# Altium project GameBoard_V1I1.PrjPcb (part 12 of 20)

## Sheet [29] - PWR IN, MECH, DOC.SchDoc
size A2; DocumentNumber: 28; SheetNumber: 28; SheetTotal: 32
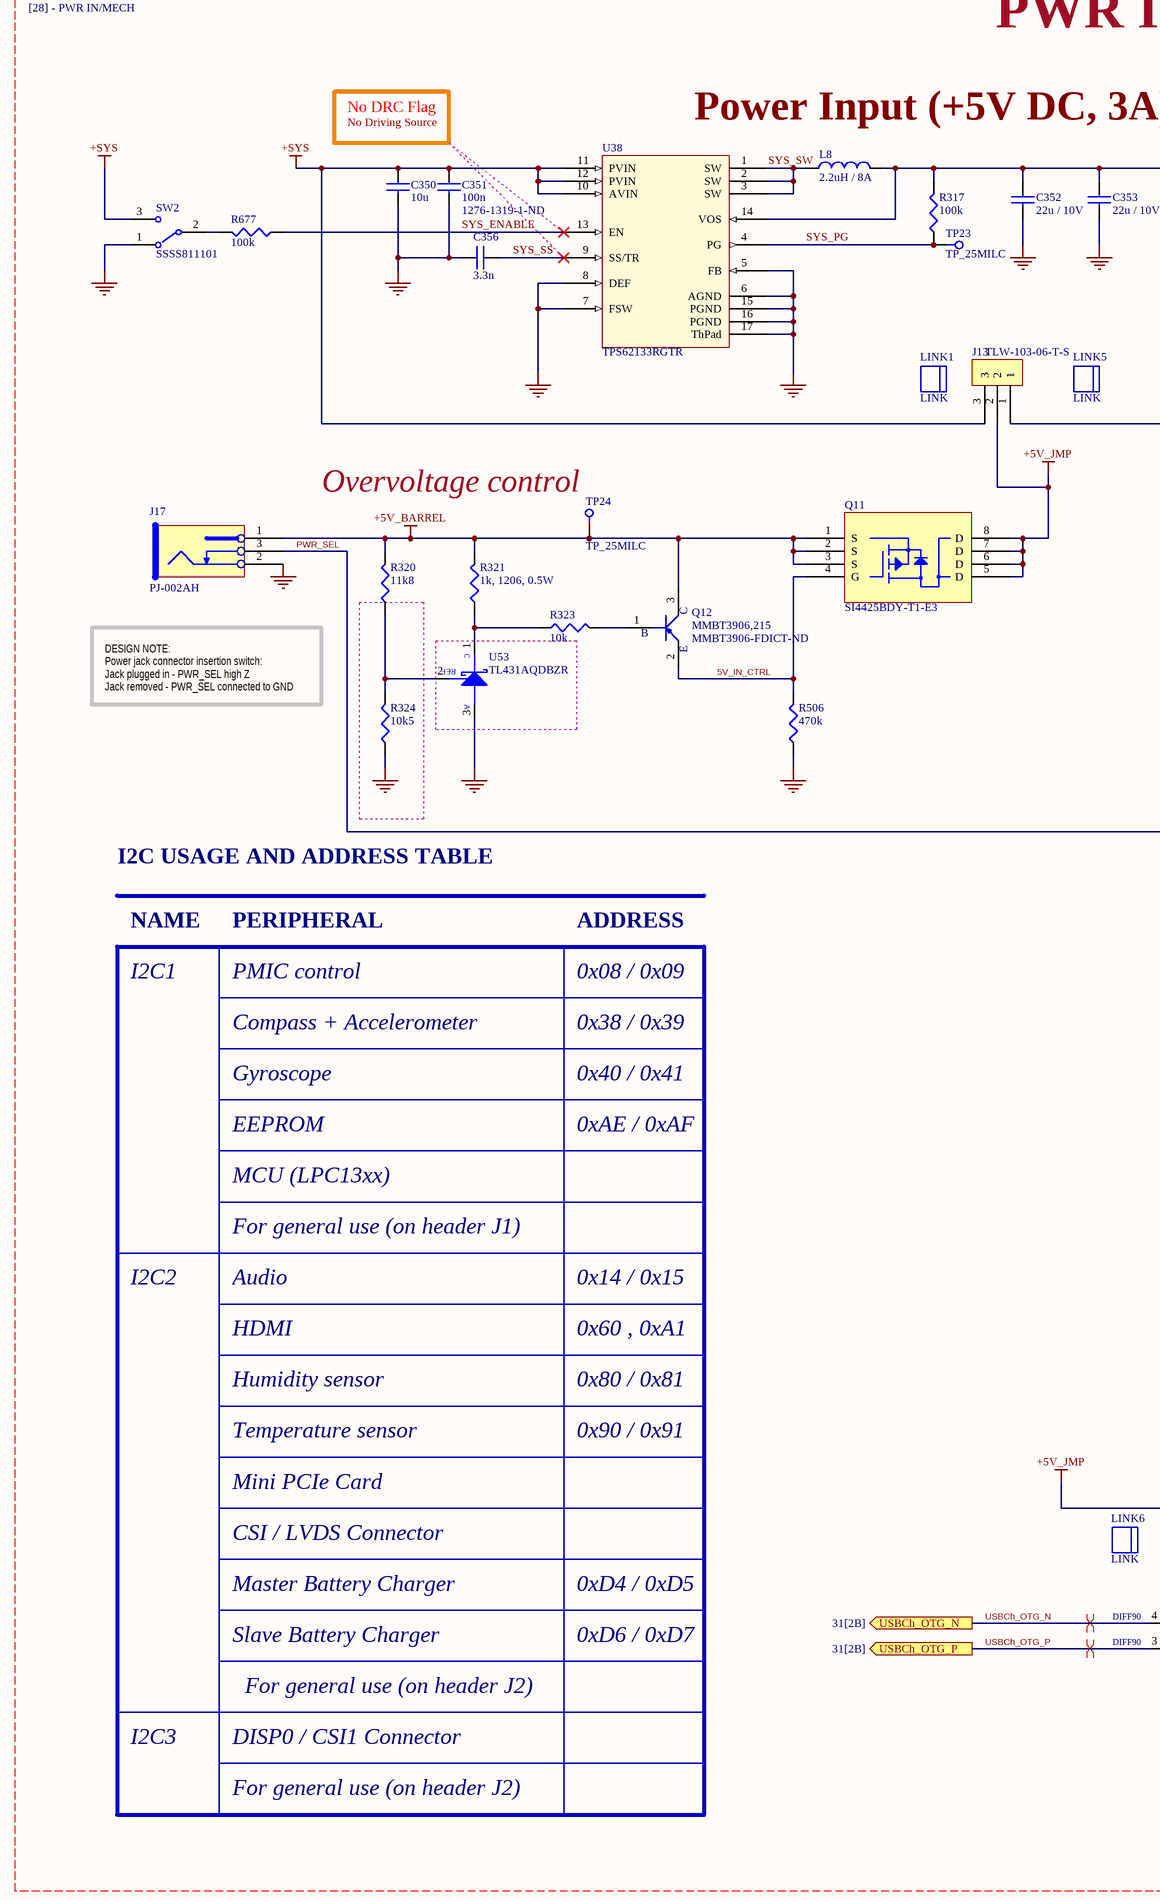
[diagram p66: [29] - PWR IN, MECH, DOC.SchDoc, left]
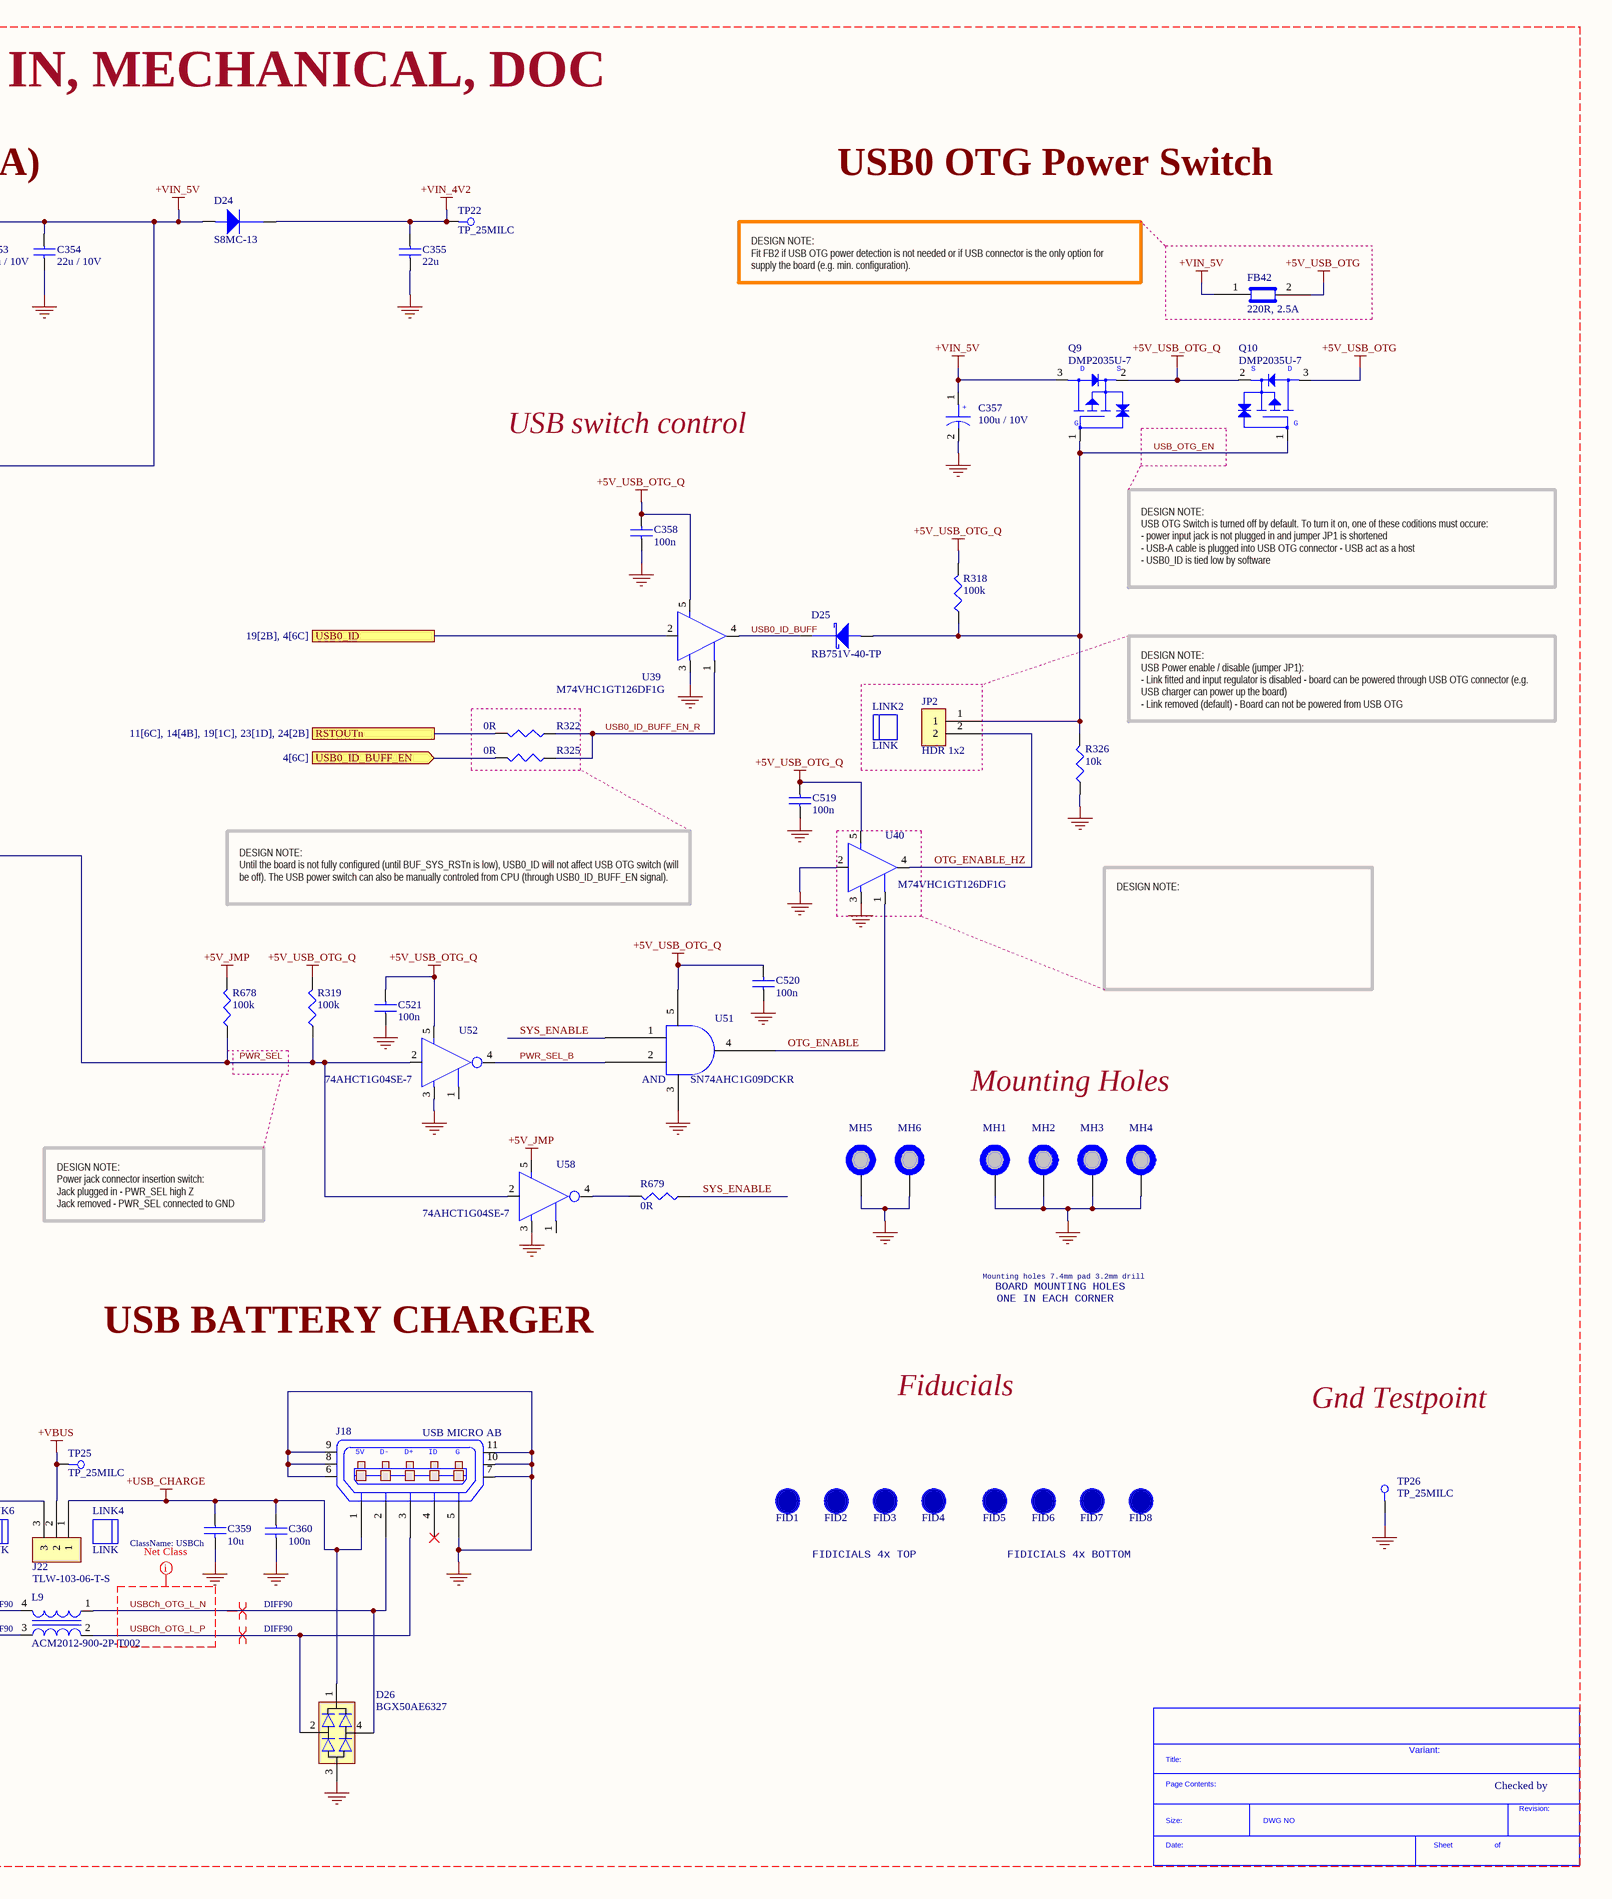
[diagram p67: [29] - PWR IN, MECH, DOC.SchDoc, right]

### Parts
(Parts that share a designator on the sheet are numbered #1, #2 ... from top to bottom, then left to right.)
*#22  SDTitleBlock  (value not drawn)  (graphical)
C350  10u  [C0603]
C351  100n  Supplier Part Number 2: 1276-1319-1-ND  [C0201]
C352  22u / 10V  [C0603]
C353  22u / 10V  [C0603]
C354  22u / 10V  [C0603]
C355  22u  [C0603]
C356  3.3n  [C0402]
C357  100u / 10V  [C2312]
C358  100n  [C0402]
C359  10u  [C0603]
C360  100n  [C0402]
C519  100n  [C0402]
C520  100n  [C0402]
C521  100n  [C0402]
D24  S8MC-13  [SMC]
D25  RB751V-40-TP  [SOD323]
D26  BGX50AE6327  [SOT143]
FB42  220R, 2.5A  [C0603]
FID1  FID_1MM_SMALL  [FID_40X52D]  (value not drawn)  (no BOM)
FID2  FID_1MM_SMALL  [FID_40X52D]  (value not drawn)  (no BOM)
FID3  FID_1MM_SMALL  [FID_40X52D]  (value not drawn)  (no BOM)
FID4  FID_1MM_SMALL  [FID_40X52D]  (value not drawn)  (no BOM)
FID5  FID_1MM_SMALL  [FID_40X52D]  (value not drawn)  (no BOM)
FID6  FID_1MM_SMALL  [FID_40X52D]  (value not drawn)  (no BOM)
FID7  FID_1MM_SMALL  [FID_40X52D]  (value not drawn)  (no BOM)
FID8  FID_1MM_SMALL  [FID_40X52D]  (value not drawn)  (no BOM)
J13  TLW-103-06-T-S  [HDR_1X3_2.54MM]
J17  PJ-002AH  [POWER_JACK_5.5_2.1MM_NS_v1.1]
J18  USB MICRO AB  [USB_Micro_AB]
J22  TLW-103-06-T-S  [HDR_1X3_2.54MM]
JP2  HDR 1x2  [HDR_1x2_2.54MM]
L8  2.2uH / 8A  [XFL4020-222MEC]
L9  ACM2012-900-2P-T002  [ACM2012]
LINK1  LINK  (mechanical)
LINK2  LINK  (mechanical)
LINK4  LINK  (mechanical)
LINK5  LINK  (mechanical)
LINK6  LINK  (mechanical)
MH1  MH_7.4MMC_3.2MMD  [MH_7.4MMD_3.2MMD]  (value not drawn)  (no BOM)
MH2  MH_7.4MMC_3.2MMD  [MH_7.4MMD_3.2MMD]  (value not drawn)  (no BOM)
MH3  MH_7.4MMC_3.2MMD  [MH_7.4MMD_3.2MMD]  (value not drawn)  (no BOM)
MH4  MH_7.4MMC_3.2MMD  [MH_7.4MMD_3.2MMD]  (value not drawn)  (no BOM)
MH5  MH_5MMC_2MMD  [MH_5MMD_2MMD]  (value not drawn)  (no BOM)
MH6  MH_5MMC_2MMD  [MH_5MMD_2MMD]  (value not drawn)  (no BOM)
Q9  DMP2035U-7  [SOT-23-3-123]
Q10  DMP2035U-7  [SOT-23-3-123]
Q11  SI4425BDY-T1-E3  [8_SOIC_3.9MM]
Q12  MMBT3906,215  Supplier Part Number 2: MMBT3906-FDICT-ND  [SOT-23-3-123]
R317  100k  [R0402]
R318  100k  [R0402]
R319  100k  [R0402]
R320  11k8  [R0402]
R321  1k, 1206, 0.5W  [R1206]
R322  0R  [R0402]
R323  10k  [R0402]
R324  10k5  [R0402]
R325  0R  [R0402]
R326  10k  [R0402]
R506  470k  [R0402]
R677  100k  [R0402]
R678  100k  [R0402]
R679  0R  [R0402]
SW2  SSSS811101  [SSSS811101]
TP22  TP_25MILC  [TP_25C]  (no BOM)
TP23  TP_25MILC  [TP_25C]  (no BOM)
TP24  TP_25MILC  [TP_25C]  (no BOM)
TP25  TP_25MILC  [TP_25C]  (no BOM)
TP26  TP_25MILC  [TP_25C]  (no BOM)
U38  TPS62133RGTR  [QFN16_3MMx3MM]
U39  M74VHC1GT126DF1G  [SC70_5]
U40  M74VHC1GT126DF1G  [SC70_5]
U51  SN74AHC1G09DCKR  [SC70_5]
U52  74AHCT1G04SE-7  [SOT353]
U53  TL431AQDBZR  [SOT-23-3-123]
U58  74AHCT1G04SE-7  [SOT353]

### Ports
RSTOUTn (see 11[6C], 14[4B], 19[1C], 23[1D], 24[2B]), USB0_ID (see 19[2B], 4[6C]), USB0_ID_BUFF_EN (in, see 4[6C]), USBCh_OTG_N (out, see 31[2B]), USBCh_OTG_P (out, see 31[2B])

### Nets
+5V_BARREL: J17.1 Q11.1(S) Q11.2(S) Q11.3(S) Q12.3(C) R320.2 R321.2 TP24.1
+5V_JMP: J13.2 J22.3 Q11.5(D) Q11.6(D) Q11.7(D) Q11.8(D) R678.2 U58.5(VCC)
+5V_USB_OTG: FB42.2 Q10.3
+5V_USB_OTG_Q: C358.2 C519.2 C520.2 C521.2 Q9.2 Q10.2 R318.2 R319.2 U39.5(VCC) U40.5(VCC) U51.5(VCC) U52.5(VCC)
+SYS: C350.1 C351.1 J13.3 SW2.3 U38.10(AVIN) U38.11(PVIN) U38.12(PVIN)
+USB_CHARGE: C359.1 C360.1 D26.1 J18.1(P1) J22.1
+VBUS: J22.2 TP25.1
+VIN_4V2: C355.1 D24.1(Cathode) TP22.1
+VIN_5V: C352.1 C353.1 C354.1 C357.1 D24.2(Anode) FB42.1 J13.1 L8.2 Q9.3 R317.2 U38.14(VOS)
GND: C350.2 C351.2 C352.2 C353.2 C354.2 C355.2 C356.1 C357.2 C358.1 C359.2 C360.2 C519.1 C520.1 C521.1 D26.3 J17.2 J18.5(P5) J18.6 J18.7 J18.8 J18.9 J18.10 J18.11 MH1.1 MH2.1 MH3.1 MH4.1 MH5.1 MH6.1 R324.1 R326.1 R506.1 SW2.1 TP26.1 U38.5(FB) U38.6(AGND) U38.7(FSW) U38.8(DEF) U38.15(PGND) U38.16(PGND) U38.17(ThPad) U39.3(GND) U40.2(I) U40.3(GND) U51.3(GND) U52.3(GND) U53.3(ANODE) U58.3(GND)
5V_IN_CTRL: Q11.4(G) Q12.2(E) R506.2
OTG_ENABLE: U40.1(OE#) U51.4(Y)
OTG_ENABLE_HZ: JP2.2 U40.4(O)
PWR_SEL: J17.3 R319.1 R678.1 U52.2(I) U58.2(I)
PWR_SEL_B: U51.2(B) U52.4(O)
RSTOUTn: R322.2 ; port RSTOUTn
SYS_ENABLE: R677.1 R679.1 U38.13(EN) U51.1(A)
SYS_PG: R317.1 TP23.1 U38.4(PG)
SYS_SS: C356.2 U38.9(SS/TR)
SYS_SW: L8.1 U38.1(SW) U38.2(SW) U38.3(SW)
USB0_ID: U39.2(I) ; port USB0_ID
USB0_ID_BUFF: D25.1(cathode) U39.4(O)
USB0_ID_BUFF_EN: R325.2 ; port USB0_ID_BUFF_EN
USB0_ID_BUFF_EN_R: R322.1 R325.1 U39.1(OE#)
USB_OTG_EN: D25.2(ANODE) JP2.1 Q9.1 Q10.1 R318.1 R326.2
USBCh_OTG_L_N: D26.4 J18.2(P2) L9.1
USBCh_OTG_L_P: D26.2 J18.3(P3) L9.2
USBCh_OTG_N: L9.4 ; port USBCh_OTG_N
USBCh_OTG_P: L9.3 ; port USBCh_OTG_P
NetQ12_1: Q12.1(B) R323.2
NetR320_1: R320.1 R324.2 U53.2(REF)
NetR321_1: R321.1 R323.1 U53.1(cathode)
NetR677_2: R677.2 SW2.2
NetR679_2: R679.2 U58.4(O)

Not connected (* = marked no-connect by the designer): J18 4(P4)*; U52 1(OE#); U58 1(OE#)

### Layout directives
differential pair; net class DIFF90: USBCh_OTG_L_N, USBCh_OTG_L_P, USBCh_OTG_N, USBCh_OTG_P
net class USBCh: USBCh_OTG_L_N, USBCh_OTG_L_P
net class [28] - PWR IN/MECH: 5V_IN_CTRL, +5V_BARREL, +5V_JMP, +5V_USB_OTG, +5V_USB_OTG_Q, +SYS, +USB_CHARGE, +VBUS, +VIN_4V2, +VIN_5V, GND, OTG_ENABLE, OTG_ENABLE_HZ, PWR_SEL, PWR_SEL_B, SYS_ENABLE, SYS_PG, SYS_SS, SYS_SW, USB0_ID_BUFF, USB0_ID_BUFF_EN_R, USB_OTG_EN, USBCh_OTG_L_N, USBCh_OTG_L_P, USBCh_OTG_N, USBCh_OTG_P

### Notes on the sheet
- PWR IN, MECHANICAL, DOC
- No DRC Flag
- No Driving Source
- Power Input (+5V DC, 3A)
- USB0 OTG Power Switch
- DESIGN NOTE:
  Fit FB2 if USB OTG power detection is not needed or if USB connector is the only option for supply the board (e.g. min. configuration).
- USB switch control
- (near TP24) Overvoltage control
- DESIGN NOTE:
  USB OTG Switch is turned off by default. To turn it on, one of these coditions must occure:
  - power input jack is not plugged in and jumper JP1 is shortened
  - USB-A cable is plugged into USB OTG connector - USB act as a host
  - USB0_ID is tied low by software
- DESIGN NOTE:
  Power jack connector insertion switch:
  Jack plugged in - PWR_SEL high Z
  Jack removed - PWR_SEL connected to GND
- DESIGN NOTE:
  USB Power enable / disable (jumper JP1):
  - Link fitted and input regulator is disabled - board can be powered through USB OTG connector (e.g. USB charger can power up the board)
  - Link removed (default) - Board can not be powered from USB OTG
- I2C USAGE AND ADDRESS TABLE
- NAME
- PERIPHERAL
- ADDRESS
- DESIGN NOTE:
  Until the board is not fully configured (until BUF_SYS_RSTn is low), USB0_ID will not affect USB OTG switch (will be off). The USB power switch can also be manually controled from CPU (through USB0_ID_BUFF_EN signal).
- DESIGN NOTE:
- I2C1
- PMIC control
- 0x08 / 0x09
- Compass + Accelerometer
- 0x38 / 0x39
- Gyroscope
- 0x40 / 0x41
- Mounting Holes
- MCU (LPC13xx)
- EEPROM
- 0xAE / 0xAF
- For general use (on header J1)
- I2C2
- Audio
- 0x14 / 0x15
- Mounting holes 7.4mm pad 3.2mm drill
- BOARD MOUNTING HOLES
- ONE IN EACH CORNER
- HDMI
- 0x60 , 0xA1
- USB BATTERY CHARGER
- Temperature sensor
- Humidity sensor
- 0x90 / 0x91
- 0x80 / 0x81
- Fiducials
- Gnd Testpoint
- Mini PCIe Card
- CSI / LVDS Connector
- FIDICIALS 4x TOP
- FIDICIALS 4x BOTTOM
- Master Battery Charger
- 0xD4 / 0xD5
- Slave Battery Charger
- For general use (on header J2)
- 0xD6 / 0xD7
- I2C3
- DISP0 / CSI1 Connector
- Variant:
- Checked by
- (in symbol 0475890001) 5V; D-; D+; ID; G
- (in symbol DMP2035U-7) D; S; G
- (in symbol SDTitleBlock) Title:; Page Contents:; Revision:; Size:; DWG NO; Date:; Sheet; of
- (in symbol SN74AHC1G09DCKR) AND
- (in symbol TL431AQDBZR) C; A
- (in symbol TPSC107K010R0150) +

### Library data of the parts
C350 C359 = C1608X5R0J106M: CAP CER 10UF 6.3V X5R 20% 0603; Manufacturer: TDK Corporation; Capacitance: 10µF; Value: 10µF; .Checked PCB: used; Category: Capacitors; Supplier Part Number: 445-4112-1-ND; Manufacturer Part Number: C1608X5R0J106M; Operating Temperature: -55°C ~ 85°C; Package / Case: 0603 (1608 Metric); Price 1k [$]: 0.08580; .Checked SCH: used; Voltage - Rated: 6.3V; Features: Low ESR; Supplier: Digikey; Supplier 1: Digi-Key; Supplier Part Number 1: 445-4112-1-ND; RoHS: RoHS Compliant; Stock 1: 48157; Pricing 1: 1=0.46, 10=0.363, 100=0.1898, 250=0.14024, 500=0.1089, 1000=0.0858 (USD); Tolerance: ±20%; Temperature Coefficient: X5R; Mounting Type: Surface Mount, MLCC; Applications: General Purpose; Ratings: -; Size / Dimension: 0.063" L x 0.031" W (1.60mm x 0.80mm); Height - Seated (Max): -; Thickness (Max): 0.037" (0.95mm); Lead Spacing: -; Packaging: Cut Tape (CT); Lead Style: -; ComponentLink1URL: http://www.tdk.com/pdf/general_B11.pdf; ComponentLink1Description: http://www.tdk.com/pdf/general_B11.pdf
C351 = C0603X5R1C104K030BC: CAP CER 0.1UF 16V 10% X5R 0201; Manufacturer: TDK Corporation; Capacitance: 0.1µF; .Creator: MM; .Checked PCB: used; Supplier 1: Digi-Key; Manufacturer Part Number: C0603X5R1C104K030BC; RoHS: RoHS Compliant; Category: Capacitors; Stock 1: 19491; Pricing 1: 1=0.1, 10=0.046, 100=0.0209, 250=0.01712, 500=0.01464, 1000=0.0114, 5000=0.0095 (USD); Packaging: Cut Tape (CT); Tolerance: ±10%; Voltage - Rated: 16V; Temperature Coefficient: X5R; Mounting Type: Surface Mount, MLCC; Operating Temperature: -55°C ~ 85°C; Applications: General Purpose; Ratings: -; Package / Case: 0201 (0603 Metric); Size / Dimension: 0.024" L x 0.012" W (0.60mm x 0.30mm); Height - Seated (Max): -; Thickness (Max): 0.013" (0.33mm); Lead Spacing: -; Features: -; Lead Style: -; ComponentLink1URL: http://product.tdk.com/en/catalog/datasheets/mlcc_commercial_general_en.pdf; ComponentLink1Description: http://product.tdk.com/en/catalog/datasheets/mlcc_commercial_general_en.pdf; Supplier Part Number 1: 445-7313-1-ND; .Checked SCH: used; Supplier 2: Digi-Key
C352-C354 = C1608X5R1A226M080AC: as C459 on sheet [30] - PWR PMIC; Supplier 1: Digi-Key; Manufacturer Part Number: C1608X5R1A226M080AC; RoHS: RoHS Compliant; Category: Capacitors; Stock 1: 405620; Pricing 1: 1=0.49, 10=0.469, 100=0.2275, 250=0.189, 500=0.1715, 1000=0.1575 (USD); Packaging: Cut Tape (CT); Voltage - Rated: 10V; Temperature Coefficient: X5R; Mounting Type: Surface Mount, MLCC; Operating Temperature: -55°C ~ 85°C; Applications: General Purpose; Ratings: -; Package / Case: 0603 (1608 Metric); Size / Dimension: 0.063" L x 0.031" W (1.60mm x 0.80mm); Height - Seated (Max): -; Thickness (Max): 0.035" (0.90mm); Lead Spacing: -; Features: -; Lead Style: -; ComponentLink1URL: http://product.tdk.com/en/catalog/datasheets/mlcc_commercial_general_en.pdf; ComponentLink1Description: http://product.tdk.com/en/catalog/datasheets/mlcc_commercial_general_en.pdf; Supplier Part Number 1: 445-9077-1-ND; .Checked PCB: used; Supplier 2: Digi-Key; Supplier Part Number 2: 1276-1274-1-ND
C355 = C1608X5R0J226M080AC: as C453-C455 on sheet [30] - PWR PMIC; Supplier 1: Digi-Key; Manufacturer Part Number: C1608X5R0J226M080AC; RoHS: RoHS Compliant; Category: Capacitors; Stock 1: 593047; Pricing 1: 1=0.39, 10=0.343, 100=0.1714, 250=0.13708, 500=0.12484, 1000=0.1104 (USD); Packaging: Cut Tape (CT); Tolerance: ±20%; Voltage - Rated: 6.3V; Temperature Coefficient: X5R; Mounting Type: Surface Mount, MLCC; Operating Temperature: -55°C ~ 85°C; Applications: General Purpose; Ratings: -; Package / Case: 0603 (1608 Metric); Size / Dimension: 0.063" L x 0.031" W (1.60mm x 0.80mm); Height - Seated (Max): -; Thickness (Max): 0.039" (1.00mm); Lead Spacing: -; Features: -; Lead Style: -; ComponentLink1URL: http://product.tdk.com/en/catalog/datasheets/mlcc_commercial_general_en.pdf; ComponentLink1Description: http://product.tdk.com/en/catalog/datasheets/mlcc_commercial_general_en.pdf; Supplier Part Number 1: 445-8028-1-ND; .Checked SCH: used
C356 = CL05B332JA5NNNC: CAP CER 3300PF 25V X7R 0402; Manufacturer: Samsung Electro-Mechanics; Tolerance: ±5%; Notification: Current market demand for these product types have resulted in fluctuating and extending lead times. Lead times may differ.; .Creator: MB; Supplier 1: Digi-Key; Manufacturer Part Number: CL05B332JA5NNNC; RoHS: RoHS Compliant; Category: Capacitors; Stock 1: 78906; Pricing 1: 1=0.1, 10=0.064, 100=0.0285, 500=0.02034, 1000=0.01598, 2500=0.01453, 5000=0.01337 (USD); Packaging: Cut Tape (CT); Part Status: Active; Voltage - Rated: 25V; Temperature Coefficient: X7R; Operating Temperature: -55°C ~ 125°C; Features: -; Ratings: -; Applications: General Purpose; Mounting Type: Surface Mount, MLCC; Package / Case: 0402 (1005 Metric); Size / Dimension: 0.039" L x 0.020" W (1.00mm x 0.50mm); Height - Seated (Max): -; Thickness (Max): 0.022" (0.55mm); Lead Spacing: -; Lead Style: -; ComponentLink1URL: https://media.digikey.com/pdf/Data%20Sheets/Samsung%20PDFs/CL05B105KQ5NQNC_Spec.pdf; ComponentLink1Description: https://media.digikey.com/pdf/Data%20Sheets/Samsung%20PDFs/CL05B105KQ5NQNC_Spec.pdf; Supplier Part Number 1: 1276-1547-1-ND; .Checked PCB: *; .Checked SCH: *
C357 = TPSC107K010R0150: CAP TANT 100UF 10V 10% 2312; Manufacturer: AVX Corporation; Manufacturer Size Code: C; Capacitance: 100µF; ESR (Equivalent Series Resistance): 150 mOhm; Type: Molded; .Creator: MM; .Checked PCB: used; Supplier 1: Digi-Key; Manufacturer Part Number: TPSC107K010R0150; RoHS: RoHS Compliant; Category: Capacitors; Stock 1: 3211; Pricing 1: 1=1, 10=0.85, 100=0.4969, 250=0.4168 (USD); Packaging: Cut Tape (CT); Tolerance: ±10%; Voltage - Rated: 10V; Operating Temperature: -55°C ~ 125°C; Mounting Type: Surface Mount; Package / Case: 2312 (6032 Metric); Size / Dimension: 0.236" L x 0.126" W (6.00mm x 3.20mm); Height - Seated (Max): 0.110" (2.80mm); Lead Spacing: -; Features: General Purpose; Lifetime @ Temp.: -; ComponentLink1URL: http://www.avx.com/docs/Catalogs/tps.pdf; ComponentLink1Description: http://www.avx.com/docs/Catalogs/tps.pdf; Supplier Part Number 1: 478-7995-1-ND; .Checked SCH: used
C358 C360 C519-C521 = C1005X5R1H104K: as C426 on sheet [30] - PWR PMIC; Category: Capacitors; Supplier Part Number: 445-5942-1-ND; Manufacturer Part Number: C1005X5R1H104K; Operating Temperature: -55°C ~ 85°C; Package / Case: 0402 (1005 Metric); Price 1k [$]: 0.02340; .Checked SCH: used; Voltage - Rated: 50V; Supplier: Digikey; Supplier 1: Digi-Key; Supplier Part Number 1: 445-5942-1-ND; RoHS: RoHS Compliant; Stock 1: 106926; Pricing 1: 1=0.27, 10=0.18, 100=0.072, 250=0.05176, 500=0.0369, 1000=0.027 (USD); Tolerance: ±10%; Temperature Coefficient: X5R; Mounting Type: Surface Mount, MLCC; Applications: General Purpose; Ratings: -; Size / Dimension: 0.039" L x 0.020" W (1.00mm x 0.50mm); Height - Seated (Max): -; Thickness (Max): 0.022" (0.55mm); Lead Spacing: -; Features: -; Packaging: Cut Tape (CT); Lead Style: -; ComponentLink1URL: http://www.tdk.co.jp/tefe02/e412_c.pdf; ComponentLink1Description: http://www.tdk.co.jp/tefe02/e412_c.pdf; Supplier 2: Digi-Key; Supplier Part Number 2: 311-1697-6-ND
D24 = S8MC-13: DIODE GEN PURP 1KV 8A SMC; Manufacturer: Diodes Incorporated; Diode Type: Standard; Voltage - DC Reverse (Vr) (Max): 1000V (1kV); Voltage - Forward (Vf) (Max) @ If: 985mV @ 8A; Speed: Standard Recovery >500ns, > 200mA (Io); Current - Reverse Leakage @ Vr: 10µA @ 1000V; Capacitance @ Vr, F: 40pF @ 4V, 1MHz; .Checked PCB: used; .Creator: MM; Supplier 1: Digi-Key; Manufacturer Part Number: S8MC-13; RoHS: RoHS Compliant; Category: Discrete Semiconductor Products; Stock 1: 79939; Pricing 1: 1=0.66, 10=0.578, 25=0.5104, 100=0.4448, 250=0.3872, 500=0.3296, 1000=0.264 (USD); Packaging: Cut Tape (CT); Current - Average Rectified (Io): 8A; Reverse Recovery Time (trr): -; Mounting Type: Surface Mount; Package / Case: DO-214AB, SMC; Supplier Device Package: SMC; Operating Temperature - Junction: -65°C ~ 150°C; ComponentLink1URL: http://www.diodes.com/datasheets/ds31117.pdf; ComponentLink1Description: http://www.diodes.com/datasheets/ds31117.pdf; Supplier Part Number 1: S8MCDICT-ND; .Checked SCH: used
D25 = RB751V-40-TP: DIODE SCHTKY 30MA 30V SOD-323; Manufacturer: Micro Commercial Co; Diode Type: Schottky; Voltage - Forward (Vf) (Max) @ If: 370mV @ 1mA; Speed: Small Signal =< 200mA (Io), Any Speed; Current - Reverse Leakage @ Vr: 500nA @ 30V; Capacitance @ Vr, F: 2pF @ 1V, 1MHz; .Checked PCB: used; Supplier 1: Digi-Key; Supplier Part Number 1: RB751V-40-TPMSCT-ND; Manufacturer Part Number: RB751V-40-TP; RoHS: RoHS Compliant; Category: Discrete Semiconductor Products; Stock 1: 18964; Pricing 1: 1=0.48, 10=0.342, 100=0.2014, 250=0.14252, 500=0.1216, 1000=0.095 (USD); Voltage - DC Reverse (Vr) (Max): 30V; Current - Average Rectified (Io): 30mA; Reverse Recovery Time (trr): -; Mounting Type: Surface Mount; Package / Case: SC-76, SOD-323; Supplier Device Package: SOD-323; Packaging: Cut Tape (CT); ComponentLink1URL: http://www.mccsemi.com/up_pdf/RB751V-40(SOD-323).PDF; ComponentLink1Description: Data Sheet; .Checked SCH: used
D26 = BGX50AE6327: DIODE SWITCHING 50V SOT-143; Manufacturer: Infineon Technologies; .Checked PCB: used; Current - DC Forward (If): 140mA; Diode Type: Single Phase; Speed: Small Signal =< 200mA (Io), Any Speed; Reverse Recovery Time (trr): 6ns; .Checked SCH: used; Category: Discrete Semiconductor Products; Family: Bridge Rectifiers; Manufacturer Part Number: BGX50AE6327; Package / Case: TO-253-4, TO-253AA; Price 1k [$]: 0.10013; Supplier: Digikey; Supplier Part Number: BGX50AINCT-ND; Value: BGX50AE6327; Supplier 1: Digi-Key; Supplier Part Number 1: BGX50AINCT-ND; RoHS: RoHS Compliant; Stock 1: 438; Pricing 1: 1=0.47, 10=0.334, 100=0.2225, 500=0.12906, 1000=0.10013 (USD); Voltage - Peak Reverse (Max): 50V; Mounting Type: Surface Mount; Packaging: Cut Tape (CT); Supplier Device Package: PG-SOT143-4; ComponentLink1URL: http://www.infineon.com/dgdl/bgx50aseries.pdf?folderId=db3a30431400ef6801141cc1c4cd04e8&fileId=db3a30431400ef6801141cc423c404e9; ComponentLink1Description: http://www.infineon.com/dgdl/bgx50aseries.pdf?folderId=db3a30431400ef6801141cc1c4cd04e8&fileId=db3a30431400ef6801141cc423c404e9
FB42 = BLM18SG221TN1D: FERRITE CHIP 220 OHM 2500MA 0603; Manufacturer: Murata Electronics North America; Impedance @ Frequency: 220 Ohm @ 100MHz; DC Resistance (DCR): 40 mOhm Max; Filter Type: Differential Mode - Single; Number of Lines: 1; .Checked PCB: used; Supplier 1: Digi-Key; Supplier Part Number 1: 490-5225-1-ND; Manufacturer Part Number: BLM18SG221TN1D; RoHS: RoHS Compliant; Category: Filters; Stock 1: 54640; Pricing 1: 1=0.38, 10=0.282, 50=0.1646, 100=0.1316, 250=0.094, 500=0.06392, 1000=0.0517, 5000=0.04042 (USD); Current Rating: 2.5A; Package / Case: 0603 (1608 Metric); Mounting Type: Surface Mount; Packaging: Cut Tape (CT); Height (Max): 0.037" (0.95mm); Size / Dimension: 0.063" L x 0.031" W (1.60mm x 0.80mm); ComponentLink1URL: http://search.murata.co.jp/Ceramy/image/img/PDF/ENG/L0110S0100BLM18S.pdf; ComponentLink1Description: http://search.murata.co.jp/Ceramy/image/img/PDF/ENG/L0110S0100BLM18S.pdf; .Checked SCH: used
FID1-FID8 = FID_1MM_SMALL: Fiducial 40mil Diameter, 52mil Mask; .Checked PCB: used; Supplier: Digikey; .Checked SCH: used
J13 J22 = TLW-103-06-T-S: CONN HEADER 3 POS 2.54mm Solder ST Thru-Hole; Manufacturer: Samtec; Number of Contacts: 3; Gender: Male; Max Current Rating: 3A; Connector Type: Male Pin; .Creator: MB; Supplier 1: Digi-Key; Manufacturer Part Number: TLW-103-06-T-S; Stock 1: 1017; Pricing 1: 1=1.02, 10=0.913, 100=0.7517, 500=0.59422, 1000=0.51009, 5000=0.46535, 10000=0.44745 (USD); Mount: Through Hole; Contact Plating: Nickel,Tin; Contact Material: Bronze; Colour: Black; Housing Colour: Black; Housing Material: Polymer; Min Operating Temperature: -55°C; Max Operating Temperature: 105°C; Number of Rows: 1; Packaging: Bulk; Termination: Solder; Package Quantity: 1; Number of Positions: 3; Orientation: Straight; Length: 7.62mm; Pitch: 2.54mm; Contact Mating Length: 0.105inch; Depth: 2.48mm; Width: 2.45mm; Radiation Hardening: No; Lead Free: Lead Free; ComponentLink1URL: https://datasheet.ciiva.com/6888/tlw-mkt-6888489.pdf; ComponentLink1Description: https://datasheet.ciiva.com/6888/tlw-mkt-6888489.pdf; ComponentLink2URL: https://datasheet.ciiva.com/10303/mtlw-th-10303518.pdf; ComponentLink2Description: https://datasheet.ciiva.com/10303/mtlw-th-10303518.pdf; Supplier Part Number 1: SAM1101-03-ND; .Checked SCH: *; .Checked PCB: *
J17 = PJ-002AH_v1.1: CONN PWR JACK 2.1X5.5MM HIGH CUR; Manufacturer: CUI Inc; .Checked PCB: used; Mating connector: 2.1mm ID, 5.5mm OD; Gender: Male; Number of Positions/Contacts: 2 Conductors, 3 Contacts; Internal Switch(s): Single Switch, Normally Closed; Shielding: Unshielded; Voltage - Rated: 24VDC; Current Rating: 5A; .Creator: MM; .Checked SCH: used; Category: Connectors, Interconnects; Family: Barrel - Power; Manufacturer Part Number: PJ-002AH; Operating Temperature: -25°C ~ 85°C; Price 1k [$]: 0.23625; Supplier: Digikey; Supplier Part Number: CP-002AH-ND; Value: PJ-002AH; Supplier 1: Digi-Key; Supplier Part Number 1: CP-002AH-ND; RoHS: RoHS Compliant; Stock 1: 138933; Pricing 1: 1=1.01, 10=0.704, 100=0.4724, 500=0.3819, 1000=0.3417, 2500=0.27135 (USD); Connector Type: Jack; Plug/Mating Plug Diameter: 2.1mm ID, 5.5mm OD; Mounting Type: Through Hole, Right Angle; Termination: Solder Eyelet(s); Features: -; Color: Black; Contact Material: Copper Alloy; Contact Material - Plating: Nickel; Housing Color: Black; Housing Material: Thermoplastic; ComponentLink1URL: http://products.cui.com/GetSpecForDigiKey.aspx?MFGNum=PJ-002AH; ComponentLink1Description: http://products.cui.com/GetSpecForDigiKey.aspx?MFGNum=PJ-002AH
J18 = 0475890001: CONN RCPT MICRO USB AB R/A SMD; Manufacturer: Molex Inc; Connector Type: USB - micro AB; Number of Contacts: 5; Gender: Receptacle; .Creator: MM; .Checked PCB: used; Supplier 1: Digi-Key; Manufacturer Part Number: 0475890001; RoHS: RoHS Compliant; Category: Connectors, Interconnects; Stock 1: 12754; Pricing 1: 1=0.81, 10=0.764, 25=0.6872, 50=0.6108, 100=0.5854, 250=0.53452, 500=0.50908 (USD); Packaging: Cut Tape (CT); Specifications: -; Mounting Type: Surface Mount, Right Angle, Horizontal; Features: Board Guide, Shielded; Ingress Protection: -; ComponentLink1URL: http://www.molex.com/pdm_docs/sd/475890001_sd.pdf; ComponentLink1Description: http://www.molex.com/pdm_docs/sd/475890001_sd.pdf; Supplier Part Number 1: WM17143CT-ND; .Checked SCH: used
JP2 = 68001-202HLF: BERGSTIK II .100" SR STRAIGHT; Manufacturer: FCI; Connector Type: Header, Unshrouded; Number of Positions: 2; Number of Positions Loaded: All; Pitch: 0.100" (2.54mm); .Checked PCB: used; Supplier 1: Digi-Key; Supplier Part Number 1: 609-3469-ND; Manufacturer Part Number: 68001-202HLF; RoHS: RoHS Compliant; Category: Connectors, Interconnects; Stock 1: 13680; Pricing 1: 1=0.45, 10=0.265, 100=0.1172, 250=0.09828, 500=0.09072, 1000=0.07938, 5000=0.05065 (USD); Contact Type: Male Pin; Number of Rows: 1; Row Spacing: -; Contact Mating Length: 0.230" (5.84mm); Mounting Type: Through Hole; Termination: Solder; Fastening Type: -; Features: -; Contact Finish: Gold; Contact Finish Thickness: 15µin (0.38µm); Color: Black; Packaging: Bulk; ComponentLink1URL: http://portal.fciconnect.com/res/en/pdffiles/doc_search/68000.pdf; ComponentLink1Description: http://portal.fciconnect.com/res/en/pdffiles/doc_search/68000.pdf; .Checked SCH: used
L8 = XFL4020-222MEC: Fixed Inductors Power Inductor 2.2 uH 20 % 8 A; Manufacturer: Coilcraft; Core Material: Composite; Shielding: Shielded; Self Resonant Frequency: 38MHz; Tolerance: 20%; DC Resistance (DCR): 23.5mR; Test Frequency: 100kHz; Saturation Current: 3.1A; .Creator: MB; Supplier 1: Mouser; Manufacturer Part Number: XFL4020-222MEC; Stock 1: 16586; Pricing 1: 1=1.99, 10=1.99, 50=1.99, 100=1.59, 1000=0.885, 10000=0.824 (USD); Mount: Surface Mount; Case/Package: SMD/SMT; Min Operating Temperature: -40°C; Max Operating Temperature: 125°C; Packaging: Tape and Reel; Inductance: 2.2uh; Max DC Current: 8A; Termination: SMD/SMT; Inductance Tolerance: 20%; RMS Current (Irms): 8A; Length: 4.3mm; Height: 2.1mm; Width: 4.3mm; Lead Free: Contains Lead; REACH SVHC: No SVHC; ComponentLink1URL: https://datasheet.ciiva.com/22679/1682010-22679277.pdf; ComponentLink1Description: https://datasheet.ciiva.com/22679/1682010-22679277.pdf; ComponentLink2URL: https://datasheet.ciiva.com/22679/1682010-22679278.pdf; ComponentLink2Description: https://datasheet.ciiva.com/22679/1682010-22679278.pdf; Supplier Part Number 1: 994-XFL4020-222MEC; .Checked SCH: *; .Checked PCB: *
L9 = ACM2012-900-2P-T002: CHOKE COMM MODE 90 OHM .4A SMD; Manufacturer: TDK Corporation; Filter Type: Data, Signal Line; Number of Lines: 2; Current: 400mA; DC Resistance (DCR): 190 mOhm Max; Impedance: 90 Ohm; Resistance (Ohms): 8.2K; Power (Watts): 0.063W, 1/16W; Temperature Coefficient: ±100ppm/°C; Tolerance: ±1%; .Checked PCB: used; Supplier 1: Digi-Key; Supplier Part Number 1: 445-2207-1-ND; Manufacturer Part Number: ACM2012-900-2P-T002; RoHS: RoHS Compliant; Category: Filters; Stock 1: 175768; Pricing 1: 1=0.48, 10=0.448, 50=0.42, 100=0.364, 500=0.308, 1000=0.252 (USD); Inductance: -; Mounting Type: Surface Mount; Size / Dimension: 0.079" L x 0.047" W (2.00mm x 1.20mm); Height (Max): 0.051" (1.30mm); Package / Case: 0805 (2012 Metric), 4 Lead; Operating Temperature: -25°C ~ 85°C; Packaging: Cut Tape (CT); ComponentLink1URL: http://www.tdk.co.jp/tefe02/e9719_acm2012.pdf; ComponentLink1Description: http://www.tdk.co.jp/tefe02/e9719_acm2012.pdf; Composition: Thick Film; Features: -; Height: 0.016" (0.40mm); Number of Terminations: 2; ComponentLink2URL: http://www.yageo.com/documents/recent/PYu-RC0402_51_RoHS_L_6.pdf; ComponentLink2Description: http://www.yageo.com/documents/recent/PYu-RC0402_51_RoHS_L_6.pdf; .Checked SCH: used; Supplier 2: Digi-Key; Supplier Part Number 2: SRF2012-900YACT-ND
LINK1 LINK2 LINK4-LINK6 = QPC02SXGN-RC: CONN JUMPER SHORTING .100" GOLD; Manufacturer: Sullins Connector Solutions; Gender: Female Sockets; Number of Positions or Pins (Grid): 2 (1 x 2); Pitch: 0.100" (2.54mm); .Checked PCB: used; Supplier 1: Digi-Key; Supplier Part Number 1: S9337-ND; Manufacturer Part Number: QPC02SXGN-RC; RoHS: RoHS Compliant; Category: Connectors, Interconnects; Stock 1: 23274; Pricing 1: 1=0.11, 10=0.066, 25=0.0468, 50=0.0384, 100=0.033, 250=0.02792, 500=0.0258, 1000=0.0228, 2500=0.018 (USD); Type: Open Top; Height: 0.235" (5.97mm); Contact Finish: Gold; Contact Finish Thickness: Flash; Color: -; Packaging: Bulk; ComponentLink1URL: http://www.sullinscorp.com/drawings/284_SXGN_11510.pdf; ComponentLink1Description: http://www.sullinscorp.com/drawings/284_SXGN_11510.pdf; .Checked SCH: used
MH1-MH4 = MH_7.4MMC_3.2MMD: Mounting Hole 7.4mm Diameter, 3.2mm Drill; .Checked PCB: used; .Creator: MM; .Checked SCH: used
MH5 MH6 = MH_5MMC_2MMD: Mounting Hole 5mm Diameter, 2mm Drill; .Checked PCB: used; .Creator: MM; .Checked SCH: used
Q9 Q10 = DMP2035U-7: MOSFET P-CH 20V 3.6A SOT-23; Manufacturer: Diodes Incorporated; FET Type: MOSFET P-Channel, Metal Oxide; FET Feature: Logic Level Gate; Current - Continuous Drain (Id) @ 25°C: 3.6A (Ta); Rds On (Max) @ Id, Vgs: 35 mOhm @ 4A, 4.5V; Vgs(th) (Max) @ Id: 1V @ 250µA; Gate Charge (Qg) @ Vgs: 15.4nC @ 4.5V; Input Capacitance (Ciss) @ Vds: 1610pF @ 10V; Power - Max: 810mW; .Checked PCB: used; .Creator: MM; Supplier 1: Digi-Key; Manufacturer Part Number: DMP2035U-7; RoHS: RoHS Compliant; Category: Discrete Semiconductor Products; Stock 1: 71721; Pricing 1: 1=0.49, 10=0.345, 25=0.2836, 100=0.2265, 250=0.165, 500=0.134, 1000=0.103 (USD); Packaging: Cut Tape (CT); Drain to Source Voltage (Vdss): 20V; Mounting Type: Surface Mount; Package / Case: TO-236-3, SC-59, SOT-23-3; Supplier Device Package: SOT-23-3; ComponentLink1URL: http://www.diodes.com/datasheets/ds31830.pdf; ComponentLink1Description: http://www.diodes.com/datasheets/ds31830.pdf; Supplier Part Number 1: DMP2035U-7DICT-ND; .Checked SCH: used
Q11 = SI4425BDY-T1-E3: MOSFET P-CH 30V 8.8A 8-SOIC; Manufacturer: Vishay Siliconix; FET Type: MOSFET P-Channel, Metal Oxide; FET Feature: Logic Level Gate; Current - Continuous Drain (Id) @ 25°C: 8.8A (Ta); Rds On (Max) @ Id, Vgs: 12 mOhm @ 11.4A, 10V; Vgs(th) (Max) @ Id: 3V @ 250µA; Gate Charge (Qg) @ Vgs: 100nC @ 10V; Power - Max: 1.5W; .Checked PCB: used; .Creator: MM; Supplier 1: Digi-Key; Manufacturer Part Number: SI4425BDY-T1-E3; RoHS: RoHS Compliant; Category: Discrete Semiconductor Products; Stock 1: 26582; Pricing 1: 1=1, 10=0.88, 25=0.7948, 100=0.6955, 250=0.60996, 500=0.54096, 1000=0.4278 (USD); Packaging: Cut Tape (CT); Drain to Source Voltage (Vdss): 30V; Input Capacitance (Ciss) @ Vds: -; Mounting Type: Surface Mount; Package / Case: 8-SOIC (0.154", 3.90mm Width); Supplier Device Package: 8-SO; ComponentLink1URL: http://www.vishay.com/docs/72000/72000.pdf; ComponentLink1Description: http://www.vishay.com/docs/72000/72000.pdf; Supplier Part Number 1: SI4425BDY-T1-E3CT-ND; .Checked SCH: used
Q12 = MMBT3906,215: TRANS PNP 40V 0.2A SOT23; Manufacturer: NXP Semiconductors; Current - Collector (Ic) (Max): 200mA; Vce Saturation (Max) @ Ib, Ic: 400mV @ 5mA, 50mA; DC Current Gain (hFE) (Min) @ Ic, Vce: 100 @ 10mA, 1V; Power - Max: 250mW; Frequency - Transition: 250MHz; .Checked PCB: used; .Creator: MM; Supplier 1: Digi-Key; Manufacturer Part Number: MMBT3906,215; RoHS: RoHS Compliant; Category: Discrete Semiconductor Products; Stock 1: 39823; Pricing 1: 1=0.14, 10=0.125, 25=0.1132, 100=0.0816, 250=0.04804, 500=0.03986, 1000=0.02719 (USD); Packaging: Cut Tape (CT); Transistor Type: PNP; Voltage - Collector Emitter Breakdown (Max): 40V; Current - Collector Cutoff (Max): -; Mounting Type: Surface Mount; Package / Case: TO-236-3, SC-59, SOT-23-3; Supplier Device Package: SOT-23 (TO-236AB); ComponentLink1URL: http://www.nxp.com/documents/data_sheet/MMBT3906.pdf; ComponentLink1Description: http://www.nxp.com/documents/data_sheet/MMBT3906.pdf; Supplier Part Number 1: 568-4511-1-ND; .Checked SCH: used; Supplier 2: Digi-Key
R317-R319 R677 R678 = RMCF0402FT100K: as R432-R434 on sheet [30] - PWR PMIC; Category: Resistors; Supplier Part Number: RMCF0402FT100KCT-ND; Manufacturer Part Number: RMCF0402FT100K; Package / Case: 0402 (1005 Metric); Price 1k [$]: 0.00384; Resistance (Ohms): 100K; Tolerance: ±1%; Value: 100k; .Checked SCH: used; Supplier: Digikey; Supplier 1: Digi-Key; Supplier Part Number 1: YAG1343DKR-ND; RoHS: RoHS Compliant; Composition: Thick Film; Features: -; Size / Dimension: 0.039" L x 0.020" W (1.00mm x 0.50mm); Height: 0.016" (0.40mm); Number of Terminations: 2; Packaging: Cut Tape (CT); ComponentLink1URL: http://www.seielect.com/Catalog/SEI-RMCF.pdf; ComponentLink1Description: http://www.seielect.com/Catalog/SEI-RMCF.pdf
R320 = CRCW040211K8FKED: RES 11.8K OHM 1/16W 1% 0402 SMD; Manufacturer: Vishay Dale; Power (Watts): 0.063W, 1/16W; Temperature Coefficient: ±100ppm/°C; .Checked PCB: used; Supplier 1: Digi-Key; Supplier Part Number 1: 541-11.8KLCT-ND; Manufacturer Part Number: CRCW040211K8FKED; RoHS: RoHS Compliant; Category: Resistors; Stock 1: 30358; Pricing 1: 10=0.083, 50=0.0444, 200=0.0255, 1000=0.0174 (USD); Resistance (Ohms): 11.8K; Composition: Thick Film; Features: -; Tolerance: ±1%; Package / Case: 0402 (1005 Metric); Size / Dimension: 0.039" L x 0.020" W (1.00mm x 0.50mm); Height: 0.016" (0.40mm); Number of Terminations: 2; Packaging: Cut Tape (CT); ComponentLink1URL: http://www.vishay.com/doc?20035; ComponentLink1Description: http://www.vishay.com/doc?20035; .Checked SCH: used; Supplier 2: Digi-Key; Supplier Part Number 2: RMCF0402FT11K8CT-ND
R321 = RNCP1206FTD1K00: RES SMD 1K OHM 1% 1/2W 1206; Manufacturer: Stackpole Electronics Inc; Power (Watts): 0.5W, 1/2W; Temperature Coefficient: ±100ppm/°C; .Checked PCB: used; .Creator: MM; Supplier 1: Digi-Key; Manufacturer Part Number: RNCP1206FTD1K00; RoHS: RoHS Compliant; Category: Resistors; Stock 1: 120283; Pricing 1: 1=0.1, 10=0.065, 50=0.0356, 100=0.0271, 250=0.02016, 500=0.01488, 1000=0.00992, 2500=0.00837 (USD); Packaging: Cut Tape (CT); Resistance (Ohms): 1k; Tolerance: ±1%; Composition: Thin Film; Features: Anti-Sulfur; Operating Temperature: -55°C ~ 155°C; Package / Case: 1206 (3216 Metric); Supplier Device Package: 1206; Size / Dimension: 0.122" L x 0.059" W (3.10mm x 1.50mm); Height: 0.024" (0.60mm); Number of Terminations: 2; ComponentLink1URL: http://www.seielect.com/catalog/SEI-RNCP.pdf; ComponentLink1Description: http://www.seielect.com/catalog/SEI-RNCP.pdf; Supplier Part Number 1: RNCP1206FTD1K00CT-ND; .Checked SCH: used
R322 R325 R679 = RC0402JR-070RL: as R430 on sheet [30] - PWR PMIC; Category: Resistors; Supplier Part Number: 311-0.0JRCT-ND; Manufacturer Part Number: RC0402JR-070RL; Package / Case: 0402 (1005 Metric); Price 1k [$]: 0.01389; Value: 0R; .Checked SCH: used; Supplier: Digikey; Supplier 1: Digi-Key; Supplier Part Number 1: 311-0.0JRCT-ND; RoHS: RoHS Compliant; Stock 1: 1106330; Pricing 1: 10=0.012, 50=0.009, 100=0.0069, 250=0.00512, 500=0.0038, 1000=0.00253 (USD); Composition: Thick Film; Features: -; Temperature Coefficient: -; Size / Dimension: 0.039" L x 0.020" W (1.00mm x 0.50mm); Height: 0.016" (0.40mm); Number of Terminations: 2; Packaging: Cut Tape (CT); ComponentLink1URL: http://www.yageo.com/documents/recent/PYu-RC0402_51_RoHS_L_6.pdf; ComponentLink1Description: http://www.yageo.com/documents/recent/PYu-RC0402_51_RoHS_L_6.pdf
R323 R326 = RC0402FR-0710KL: as R437 on sheet [30] - PWR PMIC; Category: Resistors; Supplier Part Number: 311-10.0KLRCT-ND; Manufacturer Part Number: RC0402FR-0710KL; Package / Case: 0402 (1005 Metric); Price 1k [$]: 0.01421; Resistance (Ohms): 10K; Tolerance: ±1%; Value: 10k; .Checked SCH: used; Supplier: Digikey; Supplier 1: Digi-Key; Supplier Part Number 1: 311-10.0KLRCT-ND; RoHS: RoHS Compliant; Stock 1: 2916495; Pricing 1: 10=0.014, 50=0.0104, 100=0.0079, 250=0.00584, 500=0.00432, 1000=0.00288 (USD); Composition: Thick Film; Features: -; Size / Dimension: 0.039" L x 0.020" W (1.00mm x 0.50mm); Height: 0.016" (0.40mm); Number of Terminations: 2; Packaging: Cut Tape (CT); ComponentLink1URL: http://www.yageo.com/documents/recent/PYu-RC0402_51_RoHS_L_6.pdf; ComponentLink1Description: http://www.yageo.com/documents/recent/PYu-RC0402_51_RoHS_L_6.pdf
R324 = CRCW040210K5FKED: RES 10.5K OHM 1/16W 1% 0402 SMD; Manufacturer: Vishay/Dale; Power (Watts): 0.063W, 1/16W; .Checked PCB: used; Temperature Coefficient: ±100ppm/°C; Category: Resistors; Supplier Part Number: 541-10.5KLCT-ND; Manufacturer Part Number: CRCW040210K5FKED; Package / Case: 0402 (1005 Metric); Price 1k [$]: 0.01740; Resistance (Ohms): 10.5K; Tolerance: ±1%; Value: 10k5; .Checked SCH: used; Supplier: Digikey; Supplier 1: Digi-Key; Supplier Part Number 1: 541-10.5KLCT-ND; RoHS: RoHS Compliant; Stock 1: 36157; Pricing 1: 10=0.083, 50=0.0444, 200=0.0255, 1000=0.0174 (USD); Composition: Thick Film; Features: -; Size / Dimension: 0.039" L x 0.020" W (1.00mm x 0.50mm); Height: 0.016" (0.40mm); Number of Terminations: 2; Packaging: Cut Tape (CT); ComponentLink1URL: http://www.vishay.com/doc?20035; ComponentLink1Description: http://www.vishay.com/doc?20035; Supplier 2: Digi-Key; Supplier Part Number 2: YAG2951CT-ND
R506 = CRCW0402470KFKED: RES 470K OHM 1/16W 1% 0402 SMD; Manufacturer: Vishay Dale; Power (Watts): 0.063W, 1/16W; Temperature Coefficient: ±100ppm/°C; .Checked PCB: used; Supplier 1: Digi-Key; Supplier Part Number 1: 541-470KLCT-ND; Manufacturer Part Number: CRCW0402470KFKED; RoHS: RoHS Compliant; Category: Resistors; Stock 1: 9270; Pricing 1: 10=0.083, 50=0.0444, 200=0.0255, 1000=0.0174 (USD); Resistance (Ohms): 470K; Composition: Thick Film; Features: -; Tolerance: ±1%; Size / Dimension: 0.039" L x 0.020" W (1.00mm x 0.50mm); Height: 0.016" (0.40mm); Number of Terminations: 2; Packaging: Cut Tape (CT); Package / Case: 0402 (1005 Metric); ComponentLink1URL: http://www.vishay.com/doc?20035; ComponentLink1Description: http://www.vishay.com/doc?20035; .Checked SCH: used; Supplier 2: Digi-Key; Supplier Part Number 2: RMCF0402FT470KCT-ND
SW2 = SSSS811101: Slide Switches SPDT HORZ GRND 1.5mm; Manufacturer: Alps Electric; Mechanical Life: 10000Cycles; Throw Configuration: SP,SPDT; Max Voltage Rating (DC): 5V; Contact Current Rating: 300mA; Voltage Rating (AC): 4V; Contact Resistance: 70mR; Supplier 1: Mouser; Manufacturer Part Number: SSSS811101; Stock 1: 37406; Pricing 1: 1=0.97, 10=0.97, 50=0.819, 100=0.726, 1000=0.533, 10000=0.502 (USD); Mount: Surface Mount; Case/Package: SMD/SMT; Min Operating Temperature: -10°C; Max Operating Temperature: 85°C; Termination: Gull Wing; Packaging: Tape and Reel; Electrical Life: 10000Cycles; Orientation: Right Angle; Length: 7.7mm; Depth: 5mm; Radiation Hardening: No; Lead Free: Lead Free; ComponentLink1URL: https://datasheet.ciiva.com/18147/getdatasheetpartid-652127-18147399.pdf; ComponentLink1Description: https://datasheet.ciiva.com/18147/getdatasheetpartid-652127-18147399.pdf; ComponentLink2URL: https://datasheet.ciiva.com/16174/623ssss8-16174702.pdf; ComponentLink2Description: https://datasheet.ciiva.com/16174/623ssss8-16174702.pdf; .Checked PCH: *; .Checked SCH: *; .Creator: *; Supplier Part Number 1: 688-SSSS811101
TP22-TP26 = TP_25MILC: Test Point 25mil; .Checked PCB: used
U38 = TPS62133RGTR: IC REG BUCK 5V 3A SYNC 16QFN; Manufacturer: Texas Instruments; Function: Step-Down; Output Configuration: Positive; Output Type: Fixed; Number of Outputs: 1; Voltage - Input (Min): 3V; Voltage - Input (Max): 17V; Frequency - Switching: 2.5MHz; Synchronous Rectifier: Yes; .Creator: MB; Supplier 1: Digi-Key; Manufacturer Part Number: TPS62133RGTR; RoHS: RoHS Compliant; Category: Integrated Circuits (ICs); Stock 1: 20215; Pricing 1: 1=2.35, 10=2.113, 100=1.6981, 500=1.39514, 1000=1.15597 (USD); Packaging: Cut Tape (CT); Part Status: Active; Topology: Buck; Voltage - Output (Min/Fixed): 5V; Voltage - Output (Max): -; Current - Output: 3A; Operating Temperature: -40°C ~ 85°C (TA); Mounting Type: Surface Mount; Package / Case: 16-VFQFN Exposed Pad; Supplier Device Package: 16-QFN (3x3); Base Part Number: TPS62133; ComponentLink1URL: http://www.ti.com/lit/ds/symlink/tps62130.pdf; ComponentLink1Description: http://www.ti.com/lit/ds/symlink/tps62130.pdf; Supplier Part Number 1: 296-29937-1-ND; .Checked SCH: *; .Checked PCB: *
U39 U40 = M74VHC1GT126DF1G: IC BUFF CMOS LVL/SFTR N-I SOT353; Manufacturer: ON Semiconductor; Logic Type: Buffer/Line Driver, Non-Inverting; Number of Elements: 1; Current - Output High, Low: 8mA, 8mA; Voltage - Supply: 3 V ~ 5.5 V; .Checked PCB: used; .Creator: MM; Supplier 1: Digi-Key; Manufacturer Part Number: M74VHC1GT126DF1G; RoHS: RoHS Compliant; Category: Integrated Circuits (ICs); Stock 1: 6821; Pricing 1: 1=0.36, 10=0.326, 25=0.2344, 100=0.1824, 250=0.1146, 500=0.09766, 1000=0.06654 (USD); Packaging: Cut Tape (CT); Number of Bits per Element: 1; Operating Temperature: -55°C ~ 125°C; Mounting Type: Surface Mount; Package / Case: 5-TSSOP, SC-70-5, SOT-353; Supplier Device Package: SC-70; ComponentLink1URL: http://www.onsemi.com/pub_link/Collateral/MC74VHC1GT126-D.PDF; ComponentLink1Description: http://www.onsemi.com/pub_link/Collateral/MC74VHC1GT126-D.PDF; Supplier Part Number 1: M74VHC1GT126DF1GOSCT-ND; .Checked SCH: used
U51 = SN74AHC1G09DCKR: IC GATE AND 1CH 2-INP SC-70-5; Manufacturer: Texas Instruments; Logic Type: AND Gate; Number of Circuits: 1; Number of Inputs: 2; Voltage - Supply: 2 V ~ 5.5 V; Current - Quiescent (Max): 1µA; Current - Output High, Low: -, 8mA; Logic Level - Low: 0.5 V ~ 1.65 V; Logic Level - High: 1.5 V ~ 3.85 V; Max Propagation Delay @ V, Max CL: 7.5ns @ 5V, 50pF; .Creator: MM; .Checked SCH: used; Supplier 1: Digi-Key; Manufacturer Part Number: SN74AHC1G09DCKR; RoHS: RoHS Compliant; Category: Integrated Circuits (ICs); Stock 1: 2059; Pricing 1: 1=0.49, 10=0.345, 25=0.2836, 100=0.2265, 250=0.165, 500=0.134, 750=0.11351, 1000=0.103 (USD); Packaging: Cut Tape (CT); Features: Open Drain; Operating Temperature: -55°C ~ 125°C; Mounting Type: Surface Mount; Supplier Device Package: SC-70-5; Package / Case: 6-TSSOP (5 Lead), SC-88A, SOT-353; ComponentLink1URL: http://www.ti.com/lit/ds/symlink/sn74ahc1g09.pdf; ComponentLink1Description: http://www.ti.com/lit/ds/symlink/sn74ahc1g09.pdf; Supplier Part Number 1: 296-29203-1-ND; .Checked PCB: used
U52 U58 = 74AHCT1G04SE-7: IC SINGLE INVERTER GATE SOT353; Manufacturer: Diodes; Operating Supply Voltage: 5V; Low Level Output Current: 8mA; High Level Output Current: -8mA; Max Supply Voltage: 5.5V; Min Supply Voltage: 4.5V; Number of Inputs: 1; Propagation Delay: 7.7ns; Quiescent Current: 1uA; Turn-On Delay Time: 10.05ns; Schmitt Trigger Input: No; .Creator: MB; Supplier 1: Digi-Key; Manufacturer Part Number: 74AHCT1G04SE-7; Stock 1: 6017; Pricing 1: 1=0.25, 10=0.205, 100=0.1086, 500=0.07148, 1000=0.0486 (USD); Mount: Surface Mount; Case/Package: SOT-353; Number of Pins: 5; Contact Plating: Tin,Matte; Min Operating Temperature: -40°C; Max Operating Temperature: 125°C; Logic Function: Inverter; Packaging: Tape and Reel; Output Current: 8mA; Number of Elements: 1; Package Quantity: 3000; Number of Circuits: 1; Length: 2.2mm; Height: 1mm; Width: 1.35mm; Radiation Hardening: No; REACH SVHC: No SVHC; Lead Free: Lead Free; ComponentLink1URL: https://datasheet.ciiva.com/26856/getdatasheetpartid-746016-26856226.pdf; ComponentLink1Description: https://datasheet.ciiva.com/26856/getdatasheetpartid-746016-26856226.pdf; ComponentLink2URL: https://datasheet.ciiva.com/28428/74ahct1g04-28428437.pdf; ComponentLink2Description: https://datasheet.ciiva.com/28428/74ahct1g04-28428437.pdf; ComponentLink3URL: https://datasheet.ciiva.com/12256/74ahct1g04-83266-12256775.pdf; ComponentLink3Description: https://datasheet.ciiva.com/12256/74ahct1g04-83266-12256775.pdf; ComponentLink4URL: https://datasheet.ciiva.com/1862/74ahct1g04-1862426.pdf; ComponentLink4Description: https://datasheet.ciiva.com/1862/74ahct1g04-1862426.pdf; ComponentLink5URL: https://datasheet.ciiva.com/1862/74ahct1g04-1862427.pdf; ComponentLink5Description: https://datasheet.ciiva.com/1862/74ahct1g04-1862427.pdf; ComponentLink6URL: https://datasheet.ciiva.com/1862/74ahct1g04-1862428.pdf; ComponentLink6Description: https://datasheet.ciiva.com/1862/74ahct1g04-1862428.pdf; ComponentLink7URL: https://datasheet.ciiva.com/8248/74ahct1g04-8248604.pdf; ComponentLink7Description: https://datasheet.ciiva.com/8248/74ahct1g04-8248604.pdf; ComponentLink8URL: https://datasheet.ciiva.com/16406/74ahc1g04-16406796.pdf; ComponentLink8Description: https://datasheet.ciiva.com/16406/74ahc1g04-16406796.pdf; ComponentLink9URL: https://datasheet.ciiva.com/1154/74ahct1g04-1154302.pdf; ComponentLink9Description: https://datasheet.ciiva.com/1154/74ahct1g04-1154302.pdf; Supplier Part Number 1: 74AHCT1G04SE-7DIDKR-ND; .Checked SCH: *; .Checked PCB: *
U53 = TL431AQDBZR: IC VREF SHUNT ADJ SOT23-3; Manufacturer: Texas Instruments; Output Type: Adjustable; Voltage - Output (Min/Fixed): 2.495V; Voltage - Output (Max): 36V; Current - Output: 100mA; Tolerance: ±1%; Current - Cathode: 700µA; .Checked PCB: used; .Creator: MM; Supplier 1: Digi-Key; Manufacturer Part Number: TL431AQDBZR; RoHS: RoHS Compliant; Category: Integrated Circuits (ICs); Stock 1: 14090; Pricing 1: 1=0.48, 10=0.323, 100=0.151, 1000=0.131 (USD); Packaging: Cut Tape (CT); Reference Type: Shunt; Temperature Coefficient: -; Noise - 0.1Hz to 10Hz: -; Noise - 10Hz to 10kHz: -; Voltage - Input: -; Current - Supply: -; Operating Temperature: -40°C ~ 125°C (TA); Mounting Type: Surface Mount; Package / Case: TO-236-3, SC-59, SOT-23-3; Supplier Device Package: SOT-23-3; ComponentLink1URL: http://www.ti.com/lit/ds/symlink/tl431a.pdf; ComponentLink1Description: http://www.ti.com/lit/ds/symlink/tl431a.pdf; Supplier Part Number 1: 296-18864-1-ND; .Checked SCH: used